# EAGLE design relay (EAGLE 6.5.0)
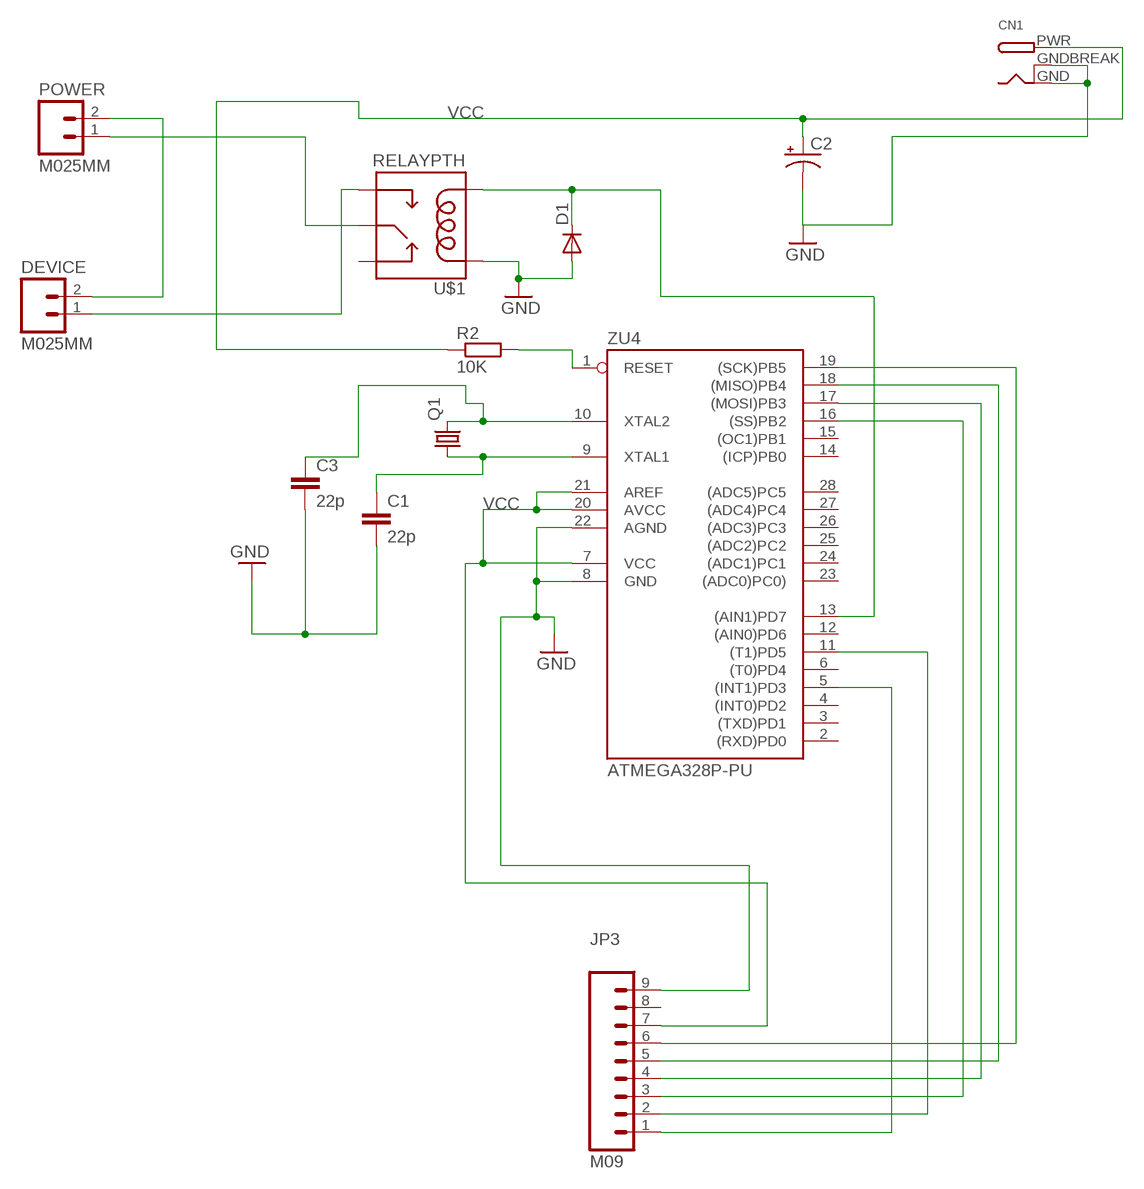
[diagram p0: schematic, sheet 1]

## Parts
C1  22p  C-EU050-025X075  [C050-025X075]
C2  CAP_POLPTH1  [CPOL-RADIAL-100UF-25V]
C3  22p  C-EU050-025X075  [C050-025X075]
CN1  DCBARRELPTH  [DCJACK_2MM_PTH]
D1  DIODE1N4148  [DIODE-1N4148]
DEVICE  M025MM  [SCREWTERMINAL-5MM-2]
JP3  M09  [1X09]
POWER  M025MM  [SCREWTERMINAL-5MM-2]
Q1  CRYSTALHC49S  [HC49/S]
R2  10K  R-EU_0207/7  [0207/7]
U$1  RELAYPTH  [RELAY-G5Q]
ZU4  ATMEGA328P-PU  [DIL28-3]

## Nets
GND [gnd]: C1.2 C2.2(-) C3.2 CN1.GND CN1.GNDBREAK D1.A JP3.9 U$1.5(COIL1) ZU4.8(GND) ZU4.22(AGND)
N$1: JP3.2 ZU4.11((T1)PD5)
N$2: JP3.1 ZU4.5((INT1)PD3)
N$3: R2.2 ZU4.1(RESET)
N$4: C1.1 Q1.1 ZU4.9(XTAL1)
N$5: JP3.6 ZU4.19((SCK)PB5)
N$6: JP3.3 ZU4.16((SS)PB2)
N$7: POWER.1 U$1.2(MAIN)
N$8: DEVICE.1 U$1.3(NO)
N$9: DEVICE.2 POWER.2
N$19: JP3.5 ZU4.18((MISO)PB4)
N$20: JP3.4 ZU4.17((MOSI)PB3)
N$26: D1.C U$1.1(COIL2) ZU4.13((AIN1)PD7)
VCC [usbvcc]: C2.1(+) CN1.PWR JP3.7 R2.1 ZU4.7(VCC) ZU4.20(AVCC) ZU4.21(AREF)
XTAL2: C3.1 Q1.2 ZU4.10(XTAL2)
Unconnected: JP3.8 U$1.4(NC) ZU4.2((RXD)PD0) ZU4.3((TXD)PD1) ZU4.4((INT0)PD2) ZU4.6((T0)PD4) ZU4.12((AIN0)PD6) ZU4.14((ICP)PB0) ZU4.15((OC1)PB1) ZU4.23((ADC0)PC0)) ZU4.24((ADC1)PC1) ZU4.25((ADC2)PC2) ZU4.26((ADC3)PC3) ZU4.27((ADC4)PC4) ZU4.28((ADC5)PC5)

## Library data of the parts
C1 C3 = resistor:C-EU: CAPACITOR, European symbol
C2 = SparkFun-Passives:CAP_POL: Capacitor Polarized These are standard SMD and PTH capacitors. Normally 10uF, 47uF, and 100uF in electrolytic and tantalum varieties. Always verify the external diameter of the through hole cap, it varies with capacity, voltage, and manufacturer. The EIA devices should be standard.
CN1 = adafruit:DCBARREL: 2.0mm DC Barrel Jack DCJACK_2MM_PTH - Through Hole Jack (4UConnector: 05537)
D1 = SparkFun-DiscreteSemi:DIODE: Diode These are standard reverse protection diodes and small signal diodes. SMA package can handle up to about 1A. SOD-323 can handle about 200mA. What the SOD-323 package when ordering, there are some mfgs out there that are 5-pin packages.
DEVICE POWER = SparkFun-Connectors:M02: Standard 2-pin 0.1" header. Use with - straight break away headers ( PRT-00116) - right angle break away headers (PRT-00553) - swiss pins (PRT-00743) - machine pins (PRT-00117) - female headers (PRT-00115) Molex polarized connector foot print use with: PRT-08233 with associated crimp pins and housings. 2.54_SCREWTERM for use with PRT-10571. 3.5mm Screw Terminal footprints for PRT-08084 5mm Screw Terminal footprints for use with PRT-08433
JP3 = SparkFun-Connectors:M09: Header 9 Standard 9-pin 0.1" header. Use with straight break away headers (SKU : PRT-00116), right angle break away headers (PRT-00553), swiss pins (PRT-00743), machine pins (PRT-00117), and female headers (PRT-00115).
Q1 = crystal:CRYSTAL: CRYSTAL; OC_FARNELL: 1667008; OC_NEWARK: unknown
R2 = resistor:R-EU_: RESISTOR, European symbol
U$1 = SparkFun-Electromechanical:RELAY: SPDT relay (COM-00101)
ZU4 = SmartPrj:ATMEGA328P-: MICROCONTROLLER 4 Kbytes FLASH 128 bytes SRAM 256 bytes EEPROM UART 6-channel 10 bit ADC

## Net classes
0 default: width 0.152 mm, clearance 0.152 mm
1 power: width 0.61 mm, drill 0.61 mm, clearance 0.254 mm
2 gnd: width 0.203 mm, drill 0.559 mm, clearance 0.152 mm
3 usbvcc: width 0.203 mm, drill 0.61 mm, clearance 0.152 mm
4 aref: width 0.406 mm, drill 0.61 mm, clearance 0.254 mm

## Board
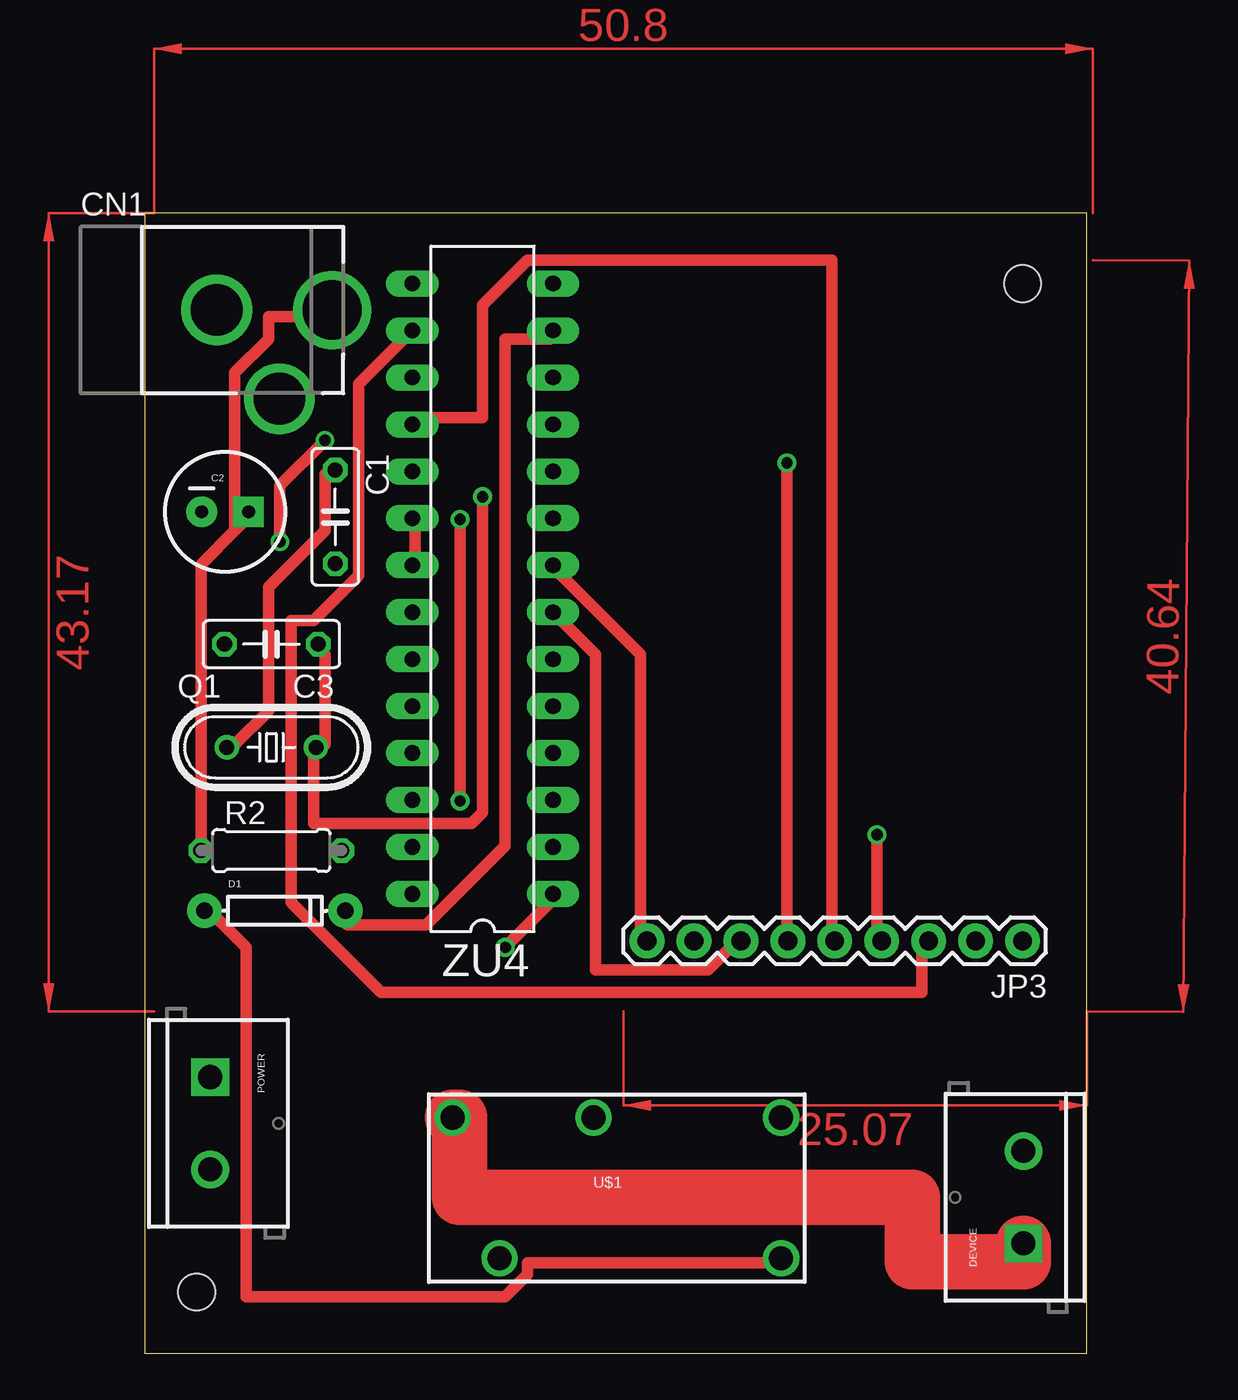
[diagram p1: board, top side]
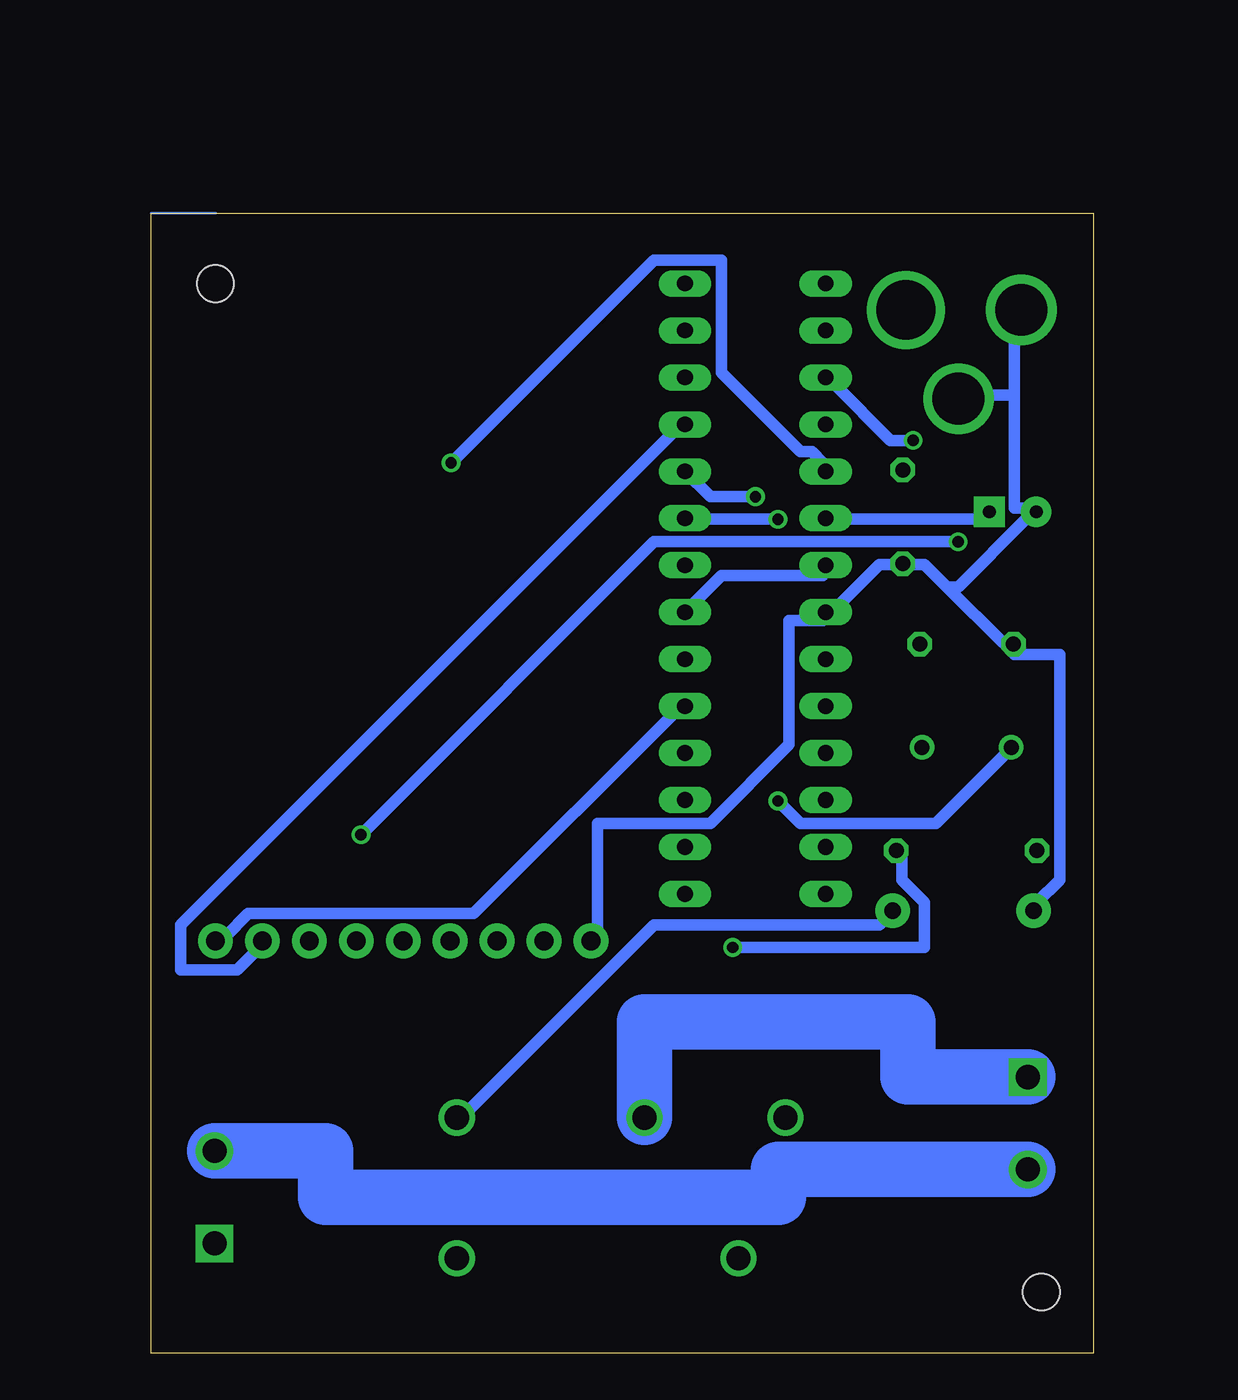
[diagram p2: board, bottom side, seen from below]

Size 50.97 x 61.67 mm. Coordinates in mm from the lower left corner, seen from the top.
Outline: 0,0 50.97,0 50.97,61.67 0,61.67 0,0
Copper layers (1*16): Top 0.035mm / dielectric 1.5mm / Bottom 0.035mm
Design rules "default *": minimum track width 24mil, minimum drill 24mil, track to track 10mil, track to pad 8mil, pad to pad 8mil, via to via 8mil, smd to smd 8mil, copper to edge 40mil, drill to drill 8mil, minimum pad ring 10mil, minimum via ring 8mil, stop-mask expansion 4mil, vias tented up to drill 0mil, thermal gap 10mil
Holes 2 mm at 47.49,57.87 2.81,3.31

### Footprints (pad centres in the part's own frame; a part is rotated, then mirrored left to right if it is on the bottom)
C050-025X075 = drill 0.813 octagon: 1 -2.54,0; 2 2.54,0
CPOL-RADIAL-100UF-25V = drill 0.7 pad 1.651 square: 1 1.27,0 | drill 0.7 pad 1.651: 2 -1.27,0
DCJACK_2MM_PTH = drill 2.8: GND 0,7.35; GNDBREAK 4.8,10.75 | drill 3.2: PWR 0,13.6
DIODE-1N4148 = drill 0.9 pad 1.88: A -3.81,0; C 3.81,0
SCREWTERMINAL-5MM-2 = drill 1.3 pad 2.032 square: 1 0,0 | drill 1.3 pad 2.032: 2 5,0
1X09 = drill 1.016 pad 1.88: 1 0,0; 2 2.54,0; 3 5.08,0; 4 7.62,0; 5 10.16,0; 6 12.7,0; 7 15.24,0; 8 17.78,0; 9 20.32,0
HC49/S = drill 0.813: 1 -2.413,0; 2 2.413,0
0207/7 = drill 0.813 octagon: 1 -3.81,0; 2 3.81,0
RELAY-G5Q = drill 1.3: 1 8.89,3.81; 2 -1.27,3.81; 3 -8.89,3.81; 4 -6.35,-3.81; 5 8.89,-3.81
DIL28-3 = drill 0.85 pad 1.422 long: 1 -16.51,-3.81; 2 -13.97,-3.81; 3 -11.43,-3.81; 4 -8.89,-3.81; 5 -6.35,-3.81; 6 -3.81,-3.81; 7 -1.27,-3.81; 8 1.27,-3.81; 9 3.81,-3.81; 10 6.35,-3.81; 11 8.89,-3.81; 12 11.43,-3.81; 13 13.97,-3.81; 14 16.51,-3.81; 15 16.51,3.81; 16 13.97,3.81; 17 11.43,3.81; 18 8.89,3.81; 19 6.35,3.81; 20 3.81,3.81; 21 1.27,3.81; 22 -1.27,3.81; 23 -3.81,3.81; 24 -6.35,3.81; 25 -8.89,3.81; 26 -11.43,3.81; 27 -13.97,3.81; 28 -16.51,3.81

### Placement (x,y rotation side)
C1  10.31,45.25 270 top
C2  4.35,45.52 0 top
C3  6.85,38.36 180 top
CN1  -3.46,56.44 270 top
D1  7.04,23.94 0 top
DEVICE  47.54,5.94 90 top
JP3  47.49,22.31 180 top
POWER  3.54,14.94 270 top
Q1  6.85,32.78 0 top
R2  6.85,27.2 0 top
U$1  25.54,8.94 0 top
ZU4  18.28,41.36 90 top

### Tracks (layer width: path | path; a pad name or v marks a point on that pad's centre or on a via)
GND
  Top 0.61: ZU4.8 22.55,42.07 26.81,37.8 26.81,22.56 JP3.9 | U$1.5 34.13,4.89 20.72,4.89 20.72,4.28 19.5,3.06 5.48,3.06 5.48,21.95 3.65,23.78 D1.A
  Bottom 0.61: 4.26,51.83 4.26,56.09 CN1.GND | 4.26,51.83 6.7,51.83 CN1.GNDBREAK | 7.92,41.46 9.14,42.68 9.75,42.68 C1.2 10.36,42.68 11.57,42.68 14.01,40.24 ZU4.22 14.62,39.63 16.45,39.63 16.45,32.93 20.72,28.66 26.81,28.66 26.81,22.56 JP3.9 | 7.92,41.46 4.87,38.41 C3.2 4.26,37.8 1.82,37.8 1.82,25.61 3.04,24.39 D1.A | 7.92,41.46 7.31,41.46 3.65,45.12 C2.2 3.65,45.73 4.26,45.73 4.26,51.83
N$1
  Bottom 0.61: ZU4.11 22.55,50 49.37,23.17 49.37,20.74 46.32,20.74 45.1,21.95 JP3.2
N$2
  Bottom 0.61: ZU4.5 22.55,34.76 33.52,23.78 45.71,23.78 46.93,22.56 JP3.1
N$3  (via drill 0.61)
  Top 0.61: v19.5,21.95 21.94,24.39 ZU4.1
  Bottom 0.61: v19.5,21.95 9.14,21.95 9.14,24.39 10.36,25.61 10.36,26.83 R2.2
N$4  (via drill 0.61)
  Top 0.61: Q1.1 4.87,32.93 6.7,34.76 6.7,41.46 9.75,44.51 9.75,47.56 C1.1 | v17.06,29.88 v17.06,45.12
  Bottom 0.61: v17.06,45.12 21.94,45.12 ZU4.9 | v17.06,29.88 15.84,28.66 8.53,28.66 4.87,32.32 Q1.1
N$5  (via drill 0.61)
  Top 0.61: v34.74,48.17 34.74,22.56 JP3.6
  Bottom 0.61: v34.74,48.17 23.77,59.14 20.11,59.14 20.11,53.04 15.84,48.78 15.23,48.78 14.62,48.17 ZU4.19
N$6
  Top 0.61: ZU4.16 11.57,52.43 11.57,42.07 9.14,39.63 7.92,39.63 7.92,24.39 12.79,19.52 42.05,19.52 42.05,21.95 JP3.3
N$7
  Bottom 3: POWER.1 10.04,14.94 10.04,17.94 24.27,17.94 U$1.2
N$8
  Top 3: U$1.3 17.04,12.75 17.04,8.44 41.54,8.44 41.54,4.94 47.54,4.94 DEVICE.1
N$9
  Bottom 3: POWER.2 17.04,9.94 17.04,8.44 41.54,8.44 41.54,10.94 DEVICE.2
N$19
  Top 0.61: ZU4.18 14.62,50.61 18.28,50.61 18.28,56.7 20.72,59.14 37.18,59.14 37.18,22.56 JP3.5
N$20  (via drill 0.61)
  Top 0.61: v9.75,49.39 7.31,46.95 v7.31,43.9 | v39.62,28.05 39.62,22.56 JP3.4
  Bottom 0.61: v9.75,49.39 10.96,49.39 14.01,52.43 ZU4.17 | v7.31,43.9 23.77,43.9 v39.62,28.05
N$26
  Top 0.61: ZU4.13 21.94,54.87 19.5,54.87 19.5,27.44 15.23,23.17 10.96,23.17 10.96,23.78 D1.C
  Bottom 0.61: U$1.1 34.13,12.81 23.77,23.17 11.57,23.17 10.96,23.78 D1.C
VCC
  Top 0.61: ZU4.21 14.62,42.68 14.62,45.12 ZU4.20 | ZU4.7 24.38,37.8 24.38,20.74 30.47,20.74 31.69,21.95 JP3.7 | R2.1 3.04,42.68 4.87,44.51 | 4.87,44.51 5.48,45.12 C2.1 | 4.87,44.51 4.87,53.04 6.7,54.87 6.7,56.09 9.75,56.09 CN1.PWR
  Bottom 0.61: ZU4.7 20.11,42.07 14.62,42.07 ZU4.21 | ZU4.20 14.01,45.12 6.09,45.12 C2.1
XTAL2  (via drill 0.61)
  Top 0.61: C3.1 9.75,37.8 9.75,32.93 Q1.2 9.14,32.32 9.14,28.66 17.67,28.66 18.28,29.27 v18.28,46.34
  Bottom 0.61: ZU4.10 20.72,46.34 v18.28,46.34
(copper drawn outside any net)
  shapes: Bottom area x1, Top area x4